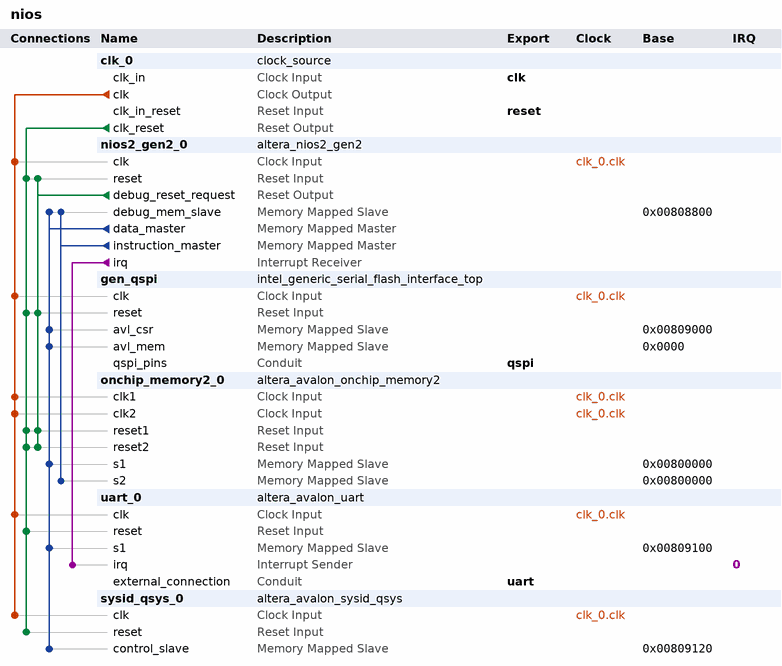
[diagram p0: system contents]
# Platform Designer (Qsys) system nios, MAX 10 10M08SAU169C8G
# Parameters at their usual value, and those the tool derives, are not listed.
package require -exact qsys 18.0
create_system nios
set_project_property DEVICE_FAMILY {MAX 10}
set_project_property DEVICE 10M08SAU169C8G

add_instance clk_0 clock_source 18.0
set_instance_parameter_value clk_0 clockFrequency 100000000

add_instance nios2_gen2_0 altera_nios2_gen2 18.0
set_instance_parameter_value nios2_gen2_0 dcache_size 2048
set_instance_parameter_value nios2_gen2_0 exceptionSlave onchip_memory2_0.s2
set_instance_parameter_value nios2_gen2_0 icache_size 4096
set_instance_parameter_value nios2_gen2_0 impl Tiny
set_instance_parameter_value nios2_gen2_0 resetSlave onchip_memory2_0.s2
set_instance_parameter_value nios2_gen2_0 resetrequest_enabled false

add_instance gen_qspi intel_generic_serial_flash_interface_top 18.0
set_instance_parameter_value gen_qspi CHIP_SELECT_BYPASS false
set_instance_parameter_value gen_qspi CHIP_SELS 1
set_instance_parameter_value gen_qspi DEBUG_OPTION 0
set_instance_parameter_value gen_qspi DEFAULT_VALUE_REG_0 1
set_instance_parameter_value gen_qspi DEFAULT_VALUE_REG_1 16
set_instance_parameter_value gen_qspi DEFAULT_VALUE_REG_2 0
set_instance_parameter_value gen_qspi DEFAULT_VALUE_REG_3 0
set_instance_parameter_value gen_qspi DEFAULT_VALUE_REG_4 0
set_instance_parameter_value gen_qspi DEFAULT_VALUE_REG_5 3
set_instance_parameter_value gen_qspi DEFAULT_VALUE_REG_6 28674
set_instance_parameter_value gen_qspi DEFAULT_VALUE_REG_7 6149
set_instance_parameter_value gen_qspi DEVICE_DENSITY 64
set_instance_parameter_value gen_qspi ENABLE_SIM_MODEL false
set_instance_parameter_value gen_qspi PIPE_CMD_GEN_CMD 0
set_instance_parameter_value gen_qspi PIPE_CSR 0
set_instance_parameter_value gen_qspi PIPE_MUX_CMD 0
set_instance_parameter_value gen_qspi PIPE_XIP 0
set_instance_parameter_value gen_qspi USE_CHIP_SEL_FROM_CSR 1
set_instance_parameter_value gen_qspi gui_use_asmiblock false
set_instance_parameter_value gen_qspi gui_use_gpio true

add_instance onchip_memory2_0 altera_avalon_onchip_memory2 18.0
set_instance_parameter_value onchip_memory2_0 dataWidth 32
set_instance_parameter_value onchip_memory2_0 dualPort true
set_instance_parameter_value onchip_memory2_0 initMemContent true
set_instance_parameter_value onchip_memory2_0 initializationFileName onchip_mem.hex
set_instance_parameter_value onchip_memory2_0 memorySize 32768
set_instance_parameter_value onchip_memory2_0 resetrequest_enabled false

add_instance uart_0 altera_avalon_uart 18.0
set_instance_parameter_value uart_0 baud 115200
set_instance_parameter_value uart_0 dataBits 8
set_instance_parameter_value uart_0 fixedBaud true
set_instance_parameter_value uart_0 parity NONE
set_instance_parameter_value uart_0 stopBits 1

add_instance sysid_qsys_0 altera_avalon_sysid_qsys 18.0
set_instance_parameter_value sysid_qsys_0 id 1

# connections
add_connection clk_0.clk gen_qspi.clk clock
add_connection clk_0.clk nios2_gen2_0.clk clock
add_connection clk_0.clk onchip_memory2_0.clk1 clock
add_connection clk_0.clk onchip_memory2_0.clk2 clock
add_connection clk_0.clk sysid_qsys_0.clk clock
add_connection clk_0.clk uart_0.clk clock
add_connection clk_0.clk_reset gen_qspi.reset reset
add_connection clk_0.clk_reset nios2_gen2_0.reset reset
add_connection clk_0.clk_reset onchip_memory2_0.reset1 reset
add_connection clk_0.clk_reset onchip_memory2_0.reset2 reset
add_connection clk_0.clk_reset sysid_qsys_0.reset reset
add_connection clk_0.clk_reset uart_0.reset reset
add_connection nios2_gen2_0.debug_reset_request gen_qspi.reset reset
add_connection nios2_gen2_0.debug_reset_request nios2_gen2_0.reset reset
add_connection nios2_gen2_0.debug_reset_request onchip_memory2_0.reset1 reset
add_connection nios2_gen2_0.debug_reset_request onchip_memory2_0.reset2 reset
add_connection nios2_gen2_0.data_master gen_qspi.avl_csr avalon
set_connection_parameter_value nios2_gen2_0.data_master/gen_qspi.avl_csr baseAddress 0x00809000
add_connection nios2_gen2_0.data_master gen_qspi.avl_mem avalon
set_connection_parameter_value nios2_gen2_0.data_master/gen_qspi.avl_mem baseAddress 0x0000
add_connection nios2_gen2_0.data_master nios2_gen2_0.debug_mem_slave avalon
set_connection_parameter_value nios2_gen2_0.data_master/nios2_gen2_0.debug_mem_slave baseAddress 0x00808800
add_connection nios2_gen2_0.data_master onchip_memory2_0.s1 avalon
set_connection_parameter_value nios2_gen2_0.data_master/onchip_memory2_0.s1 baseAddress 0x00800000
add_connection nios2_gen2_0.data_master sysid_qsys_0.control_slave avalon
set_connection_parameter_value nios2_gen2_0.data_master/sysid_qsys_0.control_slave baseAddress 0x00809120
add_connection nios2_gen2_0.data_master uart_0.s1 avalon
set_connection_parameter_value nios2_gen2_0.data_master/uart_0.s1 baseAddress 0x00809100
add_connection nios2_gen2_0.instruction_master nios2_gen2_0.debug_mem_slave avalon
set_connection_parameter_value nios2_gen2_0.instruction_master/nios2_gen2_0.debug_mem_slave baseAddress 0x00808800
add_connection nios2_gen2_0.instruction_master onchip_memory2_0.s2 avalon
set_connection_parameter_value nios2_gen2_0.instruction_master/onchip_memory2_0.s2 baseAddress 0x00800000
add_connection nios2_gen2_0.irq uart_0.irq interrupt
set_connection_parameter_value nios2_gen2_0.irq/uart_0.irq irqNumber 0

# exported interfaces
add_interface clk clock sink
set_interface_property clk EXPORT_OF clk_0.clk_in
add_interface qspi conduit end
set_interface_property qspi EXPORT_OF gen_qspi.qspi_pins
add_interface reset reset sink
set_interface_property reset EXPORT_OF clk_0.clk_in_reset
add_interface uart conduit end
set_interface_property uart EXPORT_OF uart_0.external_connection

set_interconnect_requirement {$system} qsys_mm.clockCrossingAdapter HANDSHAKE
set_interconnect_requirement {$system} qsys_mm.enableEccProtection FALSE
set_interconnect_requirement {$system} qsys_mm.insertDefaultSlave FALSE
set_interconnect_requirement {$system} qsys_mm.maxAdditionalLatency 1

save_system nios.qsys
